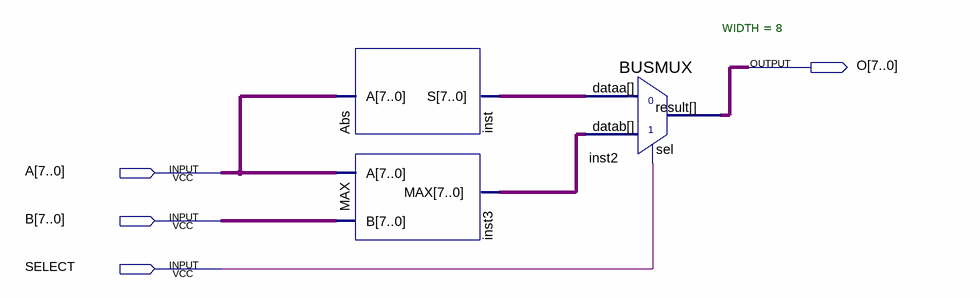
[diagram p0: schematic sheet]
// Quartus schematic ABS_MAX.bdf as structural Verilog: 3 symbols, 4 pins
module ABS_MAX (
  input  [7:0] A,
  input  [7:0] B,
  input  SELECT,
  output [7:0] O
);

  wire [7:0] inst3_max, inst_s;

  Abs inst (.A(A), .S(inst_s));
  MAX inst3 (.A(A), .B(B), .MAX(inst3_max));
  BUSMUX #(.WIDTH(8)) inst2 (.datab(inst3_max), .sel(SELECT), .dataa(inst_s), .result(O));
endmodule
